# EAGLE design PL2303Module_Schematic (EAGLE 6.0)
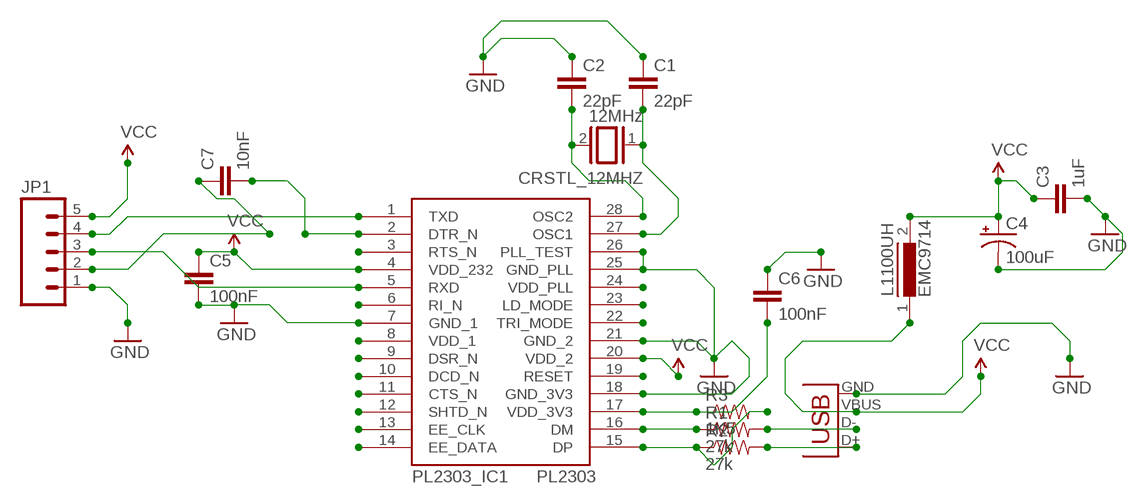
[diagram p0: schematic, sheet 1]

## Parts
C1  22pF  CAP1206  [1206]
C2  22pF  CAP1206  [1206]
C3  1uF  CAPPTH2  [CAP-PTH-SMALL2]
C4  100uF  CAP_POLPTH1  [CPOL-RADIAL-100UF-25V]
C5  100nF  CAPPTH2  [CAP-PTH-SMALL2]
C6  100nF  CAP1206  [1206]
C7  10nF  CAP1206  [1206]
CRSTL_12MHZ  12MHz  XTAL  [Q]
JP1  M05PTH_LONGPADS  [1X05_LONGPADS]
L1100UH  EMC9714  [EMC9714]
PL2303_IC1  PL2303-SSOP28  [PL2303-SSOP28]
R1  27k  RESISTOR0805-RES  [0805]
R2  27k  RESISTOR0805-RES  [0805]
R3  1K5  RESISTOR1206  [1206]
X1  USBSMD  [USB-MINIB]

## Nets
GND: C1.1 C2.1 C3.2 C4.2(-) C5.2 C6.1 JP1.1 PL2303_IC1.7(GND_1) PL2303_IC1.18(GND_3V3) PL2303_IC1.21(GND_2) PL2303_IC1.25(GND_PLL) PL2303_IC1.26(PLL_TEST) X1.GND
N$1: C7.1 JP1.2
N$3: R1.2 X1.D-
N$4: C7.2 PL2303_IC1.2(DTR_N)
N$11: C2.2 CRSTL_12MHZ.2 PL2303_IC1.28(OSC2)
N$12: C1.2 CRSTL_12MHZ.1 PL2303_IC1.27(OSC1)
N$19: PL2303_IC1.16(DM) R1.1
N$22: R2.2 X1.D+
N$25: C6.2 PL2303_IC1.17(VDD_3V3) R3.1
N$27: PL2303_IC1.19(RESET)
N$30: PL2303_IC1.22(TRI_MODE)
N$31: PL2303_IC1.23(LD_MODE)
N$32: PL2303_IC1.24(VDD_PLL)
N$35: PL2303_IC1.14(EE_DATA)
N$36: PL2303_IC1.13(EE_CLK)
N$37: PL2303_IC1.12(SHTD_N)
N$38: PL2303_IC1.11(CTS_N)
N$39: PL2303_IC1.10(DCD_N)
N$40: PL2303_IC1.9(DSR_N)
N$41: PL2303_IC1.8(VDD_1)
N$43: PL2303_IC1.6(RI_N)
N$44: JP1.3 PL2303_IC1.5(RXD)
N$46: PL2303_IC1.3(RTS_N)
N$50: PL2303_IC1.15(DP) R2.1 R3.2
N$56: JP1.4 PL2303_IC1.1(TXD)
VCC: C3.1 C4.1(+) C5.1 JP1.5 L1100UH.1 L1100UH.2 PL2303_IC1.4(VDD_232) PL2303_IC1.20(VDD_2) X1.VBUS

## Library data of the parts
C1 C2 C5-C7 = SparkFun-Capacitors:CAP: Capacitor Standard 0603 ceramic capacitor, and 0.1" leaded capacitor.
C3 = SparkFun-Passives:CAP: Capacitor Standard 0603 ceramic capacitor, and 0.1" leaded capacitor.
C4 = SparkFun-Passives:CAP_POL: Capacitor Polarized These are standard SMD and PTH capacitors. Normally 10uF, 47uF, and 100uF in electrolytic and tantalum varieties. Always verify the external diameter of the through hole cap, it varies with capacity, voltage, and manufacturer. The EIA devices should be standard.
CRSTL_12MHZ = special:XTAL: CRYSTAL
JP1 = SparkFun-Connectors:M05: Header 5 Standard 5-pin 0.1" header. Use with straight break away headers (SKU : PRT-00116), right angle break away headers (PRT-00553), swiss pins (PRT-00743), machine pins (PRT-00117), and female headers (PRT-00115). Molex polarized connector foot print use with SKU : PRT-08230 with associated crimp pins and housings.
L1100UH = inductors:EMC9714: INDUCTOR
PL2303_IC1 = ic-PL2303HX-usb-to-serial-bridge:PL2303-SSOP28: The PL-2303 operates as a bridge between one USB port and one standard RS232 Serial port. Automatic handshake is supported at the Serial port. With these, a much higher baud rate can be achieved compared to the legacy UART controller.
R1-R3 = SparkFun-Resistors:RESISTOR: Resistor Basic schematic elements and footprints for 0603, 1206, and PTH resistors.
X1 = SparkFun-Connectors:USB: USB Connectors USB-B-PTH is fully proven SKU : PRT-00139/CONN-08278 USB-miniB is fully proven SKU : PRT-00587 USB-A-PCB is untested. USB-A-H is throughly reviewed, but untested. Spark Fun Electronics SKU : PRT-00437 USB-B-SMT is throughly reviewed, but untested. Needs silkscreen touching up. USB-A-S has not been used/tested USB-MB-H has not been used/tested USB-MICROB has been used. CONN-09505

## Board
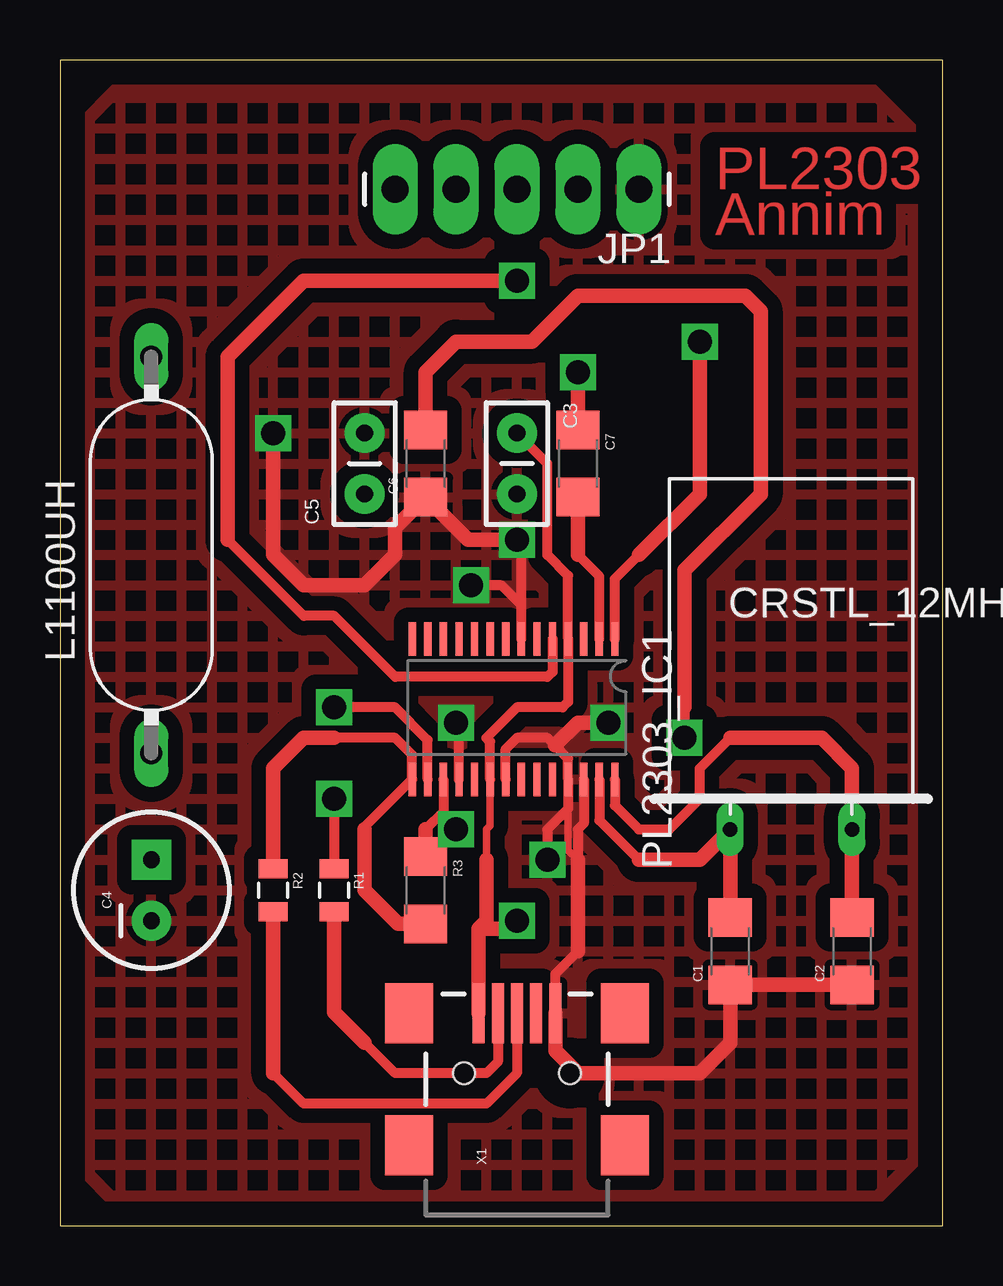
[diagram p1: board, top side]
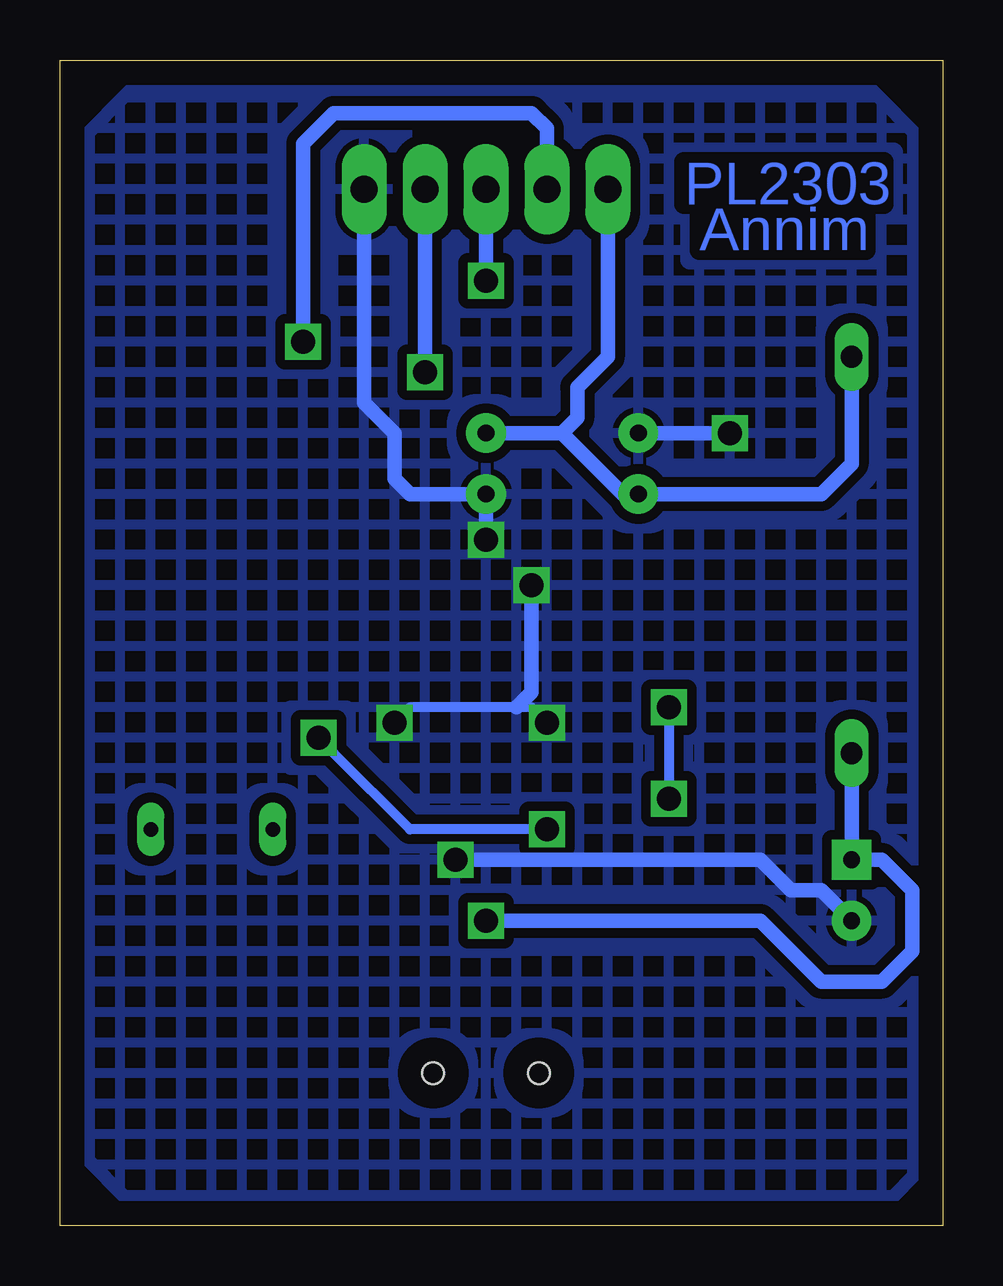
[diagram p2: board, bottom side, seen from below]

Size 36.81 x 48.56 mm. Coordinates in mm from the lower left corner, seen from the top.
Outline: 0,0 36.81,0 36.81,48.56 0,48.56 0,0
Copper layers (1*16): Top 0.035mm / dielectric 1.5mm / Bottom 0.035mm
Design rules: minimum track width 10mil, minimum drill 24mil, track to track 8mil, track to pad 8mil, pad to pad 8mil, via to via 8mil, smd to smd 8mil, copper to edge 40mil, drill to drill 8mil, minimum pad ring 10mil, minimum via ring 8mil, stop-mask expansion 4mil, vias tented up to drill 0mil, thermal gap 10mil

### Footprints (pad centres in the part's own frame; a part is rotated, then mirrored left to right if it is on the bottom)
1206 = smd 1.6 x 1.8: 1 -1.4,0; 2 1.4,0
CAP-PTH-SMALL2 = drill 0.7 pad 1.651: 1 0,0; 2 2.54,0
CPOL-RADIAL-100UF-25V = drill 0.7 pad 1.651 square: 1 1.27,0 | drill 0.7 pad 1.651: 2 -1.27,0
Q = drill 0.61 long: 1 -2.54,-7.62; 2 2.54,-7.62
1X05_LONGPADS = drill 1.118 pad 1.88 long: 1 0,0; 2 2.54,0; 3 5.08,0; 4 7.62,0; 5 10.16,0
EMC9714 = drill 0.914 long: 1 -8.255,0; 2 8.255,0
PL2303-SSOP28 = smd 1.397 x 0.305: 1 -2.855,4.084; 2 -2.855,3.434; 3 -2.855,2.784; 4 -2.855,2.134; 5 -2.855,1.483; 6 -2.855,0.833; 7 -2.855,0.183; 8 -2.855,-0.467; 9 -2.855,-1.118; 10 -2.855,-1.768; 11 -2.855,-2.418; 12 -2.855,-3.068; 13 -2.855,-3.719; 14 -2.855,-4.369; 15 2.997,-4.369; 16 2.997,-3.719; 17 2.997,-3.068; 18 2.997,-2.418; 19 2.997,-1.768; 20 2.997,-1.118; 21 2.997,-0.467; 22 2.997,0.183; 23 2.997,0.833; 24 2.997,1.483; 25 2.997,2.134; 26 2.997,2.784; 27 2.997,3.434; 28 2.997,4.084
0805 = smd 0.8 x 1.2: 1 -0.9,0; 2 0.9,0
USB-MINIB = smd 2.5 x 0.5: D+ 2.5,0; D- 2.5,0.8; GND 2.5,-1.6; ID 2.5,-0.8; VBUS 2.5,1.6 | smd 2.5 x 2: MTN1 -3,4.5; MTN2 2.5,4.5; MTN3 -3,-4.5; MTN4 2.5,-4.5 | hole 0.9: 0,2.2; 0,-2.2

### Placement (x,y rotation side)
C1  27.94,11.43 90 top
C2  33.02,11.43 90 top
C3  19.05,33.02 270 top
C4  3.81,13.97 90 top
C5  12.7,30.48 90 top
C6  15.24,31.75 90 top
C7  21.59,31.75 270 top
CRSTL_12MHZ  30.48,24.13 0 top
JP1  24.13,43.18 180 top
L1100UH  3.81,27.94 90 top
PL2303_IC1  19.05,21.59 270 top
R1  11.43,13.97 270 top
R2  8.89,13.97 270 top
R3  15.24,13.97 270 top
X1  19.05,6.35 90 top

### Tracks (layer width: path | path; a pad name or v marks a point on that pad's centre or on a via)
GND  (via drill 1)
  Top 0.305: PL2303_IC1.25 21.18,15.65 21.59,15.24
  Top 0.406: X1.GND 20.65,10.49 21.59,11.43 | PL2303_IC1.26 21.83,16.75 21.59,16.51 21.59,15.24 | v20.32,15.24 20.32,16.51 21.18,17.37 PL2303_IC1.25 21.18,19.46 20.64,20 20.32,20.32 19.05,20.32 18.58,19.85 PL2303_IC1.21 | v19.05,28.57 19.23,28.39 PL2303_IC1.7 19.23,25.85 18.41,26.67 v17.14,26.67 | PL2303_IC1.18 16.63,20.83 v16.51,20.95
  Top 0.61: X1.GND 20.65,7.29 21.59,6.35 26.67,6.35 27.94,7.62 C1.1 C2.1 | 21.59,15.24 21.59,11.43 | v8.89,33.02 8.89,27.94 10.16,26.67 12.7,26.67 13.97,27.94 13.97,29.08 C6.1 17.02,28.57 v19.05,28.57 | v22.86,20.95 21.59,20.95 20.64,20
  Bottom 0.406: v16.51,20.95 17.14,21.59 17.78,21.59 22.23,21.59 v22.86,20.95
  Bottom 0.61: v20.32,15.24 7.62,15.24 6.35,13.97 5.08,13.97 C4.2 | C5.2 v8.89,33.02 | v19.05,28.57 C3.2 22.23,30.48 22.86,31.11 22.86,33.02 24.13,34.29 JP1.1 | v17.14,26.67 17.14,22.23 17.78,21.59
  pour Bottom (isolate 0.406, hatched): 4.45,48.26 3.81,48.26 0,44.45 0,3.17 3.17,0 33.02,0 36.83,3.81 36.83,44.45 33.02,48.26 5.08,48.26
  pour Top (isolate 0.61, hatched): 4.45,48.26 3.17,48.26 0,45.09 0,3.17 3.17,0 33.02,0 36.83,3.81 36.83,44.45 33.02,48.26
N$1  (via drill 1)
  Top 0.61: C7.1 v21.59,35.56
  Bottom 0.61: v21.59,35.56 JP1.2
N$3
  Top 0.406: X1.D- 18.25,6.82 17.78,6.35 13.97,6.35 12.7,7.62
  Top 0.61: 12.7,7.62 11.43,8.89 R1.2
N$4
  Top 0.406: PL2303_IC1.2 22.48,27.05 21.59,27.94
  Top 0.61: 21.59,27.94 C7.2
N$11
  Top 0.406: PL2303_IC1.28 23.13,17.51 24.13,16.51 25.4,16.51 26.67,17.78 26.67,19.05 27.94,20.32
  Top 0.61: C2.2 CRSTL_12MHZ.2 33.02,19.05 31.75,20.32 27.94,20.32
N$12
  Top 0.406: PL2303_IC1.27 22.48,16.89 24.13,15.24
  Top 0.61: C1.2 CRSTL_12MHZ.1 26.67,15.24 24.13,15.24
N$19  (via drill 1)
  Top 0.406: PL2303_IC1.16 15.33,20.23 13.97,21.59 v11.43,21.59 | v11.43,17.78 R1.1
  Bottom 0.406: v11.43,21.59 v11.43,17.78
N$22
  Top 0.406: X1.D+ 19.05,6.35 17.78,5.08 10.16,5.08 8.89,6.35
  Top 0.61: 8.89,6.35 R2.2
N$25  (via drill 1)
  Top 0.406: 15.24,16.51 15.98,17.25 PL2303_IC1.17 15.98,17.04 v16.51,16.51 | 26.04,21.59 v26.04,20.32
  Top 0.61: 15.24,16.51 R3.1 | C6.2 15.24,35.56 16.51,36.83 19.68,36.83 21.59,38.73 28.57,38.73 29.21,38.1 29.21,30.48 26.04,27.3 26.04,21.59
  Bottom 0.406: v16.51,16.51 22.23,16.51 25.4,19.68 v26.04,20.32
N$44  (via drill 1)
  Top 0.406: PL2303_IC1.5 20.53,23.07 20.32,22.86 13.97,22.86 11.43,25.4 10.16,25.4 6.99,28.57
  Top 0.61: v19.05,39.37 10.16,39.37 6.99,36.2 6.99,28.57
  Bottom 0.61: JP1.3 v19.05,39.37
N$50
  Top 0.406: 11.43,20.32 13.97,20.32 14.68,19.61 PL2303_IC1.15 12.7,16.61 12.7,16.51
  Top 0.61: 11.43,20.32 10.16,20.32 8.89,19.05 R2.1 | R3.2 14.1,12.57 12.7,13.97 12.7,16.51
N$56  (via drill 1)
  Top 0.406: PL2303_IC1.1 23.13,26.94 24.13,27.94
  Top 0.61: v26.67,36.83 26.67,30.48 24.13,27.94
  Bottom 0.61: JP1.4 16.51,45.72 17.14,46.35 25.4,46.35 26.67,45.09 v26.67,36.83
VCC  (via drill 1)
  Top 0.305: PL2303_IC1.20 17.93,16.66 17.78,16.51 17.78,15.24
  Top 0.406: PL2303_IC1.20 17.93,20.17 17.78,20.32 19.05,21.59 20.95,21.59 21.18,21.82 PL2303_IC1.4 21.18,27.08 20.32,27.94 20.32,31.75 C3.1
  Top 0.61: X1.VBUS 17.45,12.37 | 17.45,12.37 17.78,12.7 17.78,15.24 | 17.45,12.37 18.72,12.37 v19.05,12.7
  Bottom 0.61: L1100UH.1 C4.1 2.54,15.24 1.27,13.97 1.27,11.43 2.54,10.16 5.08,10.16 7.62,12.7 v19.05,12.7 | L1100UH.2 3.81,31.75 5.08,30.48 C5.1 13.34,30.48 15.88,33.02 | 15.88,33.02 C3.1 | JP1.5 13.97,36.2 15.24,34.92 15.24,33.66 15.88,33.02

### Text on the board
Top: PL2303 | Annim
Bottom: PL2303 | Annim